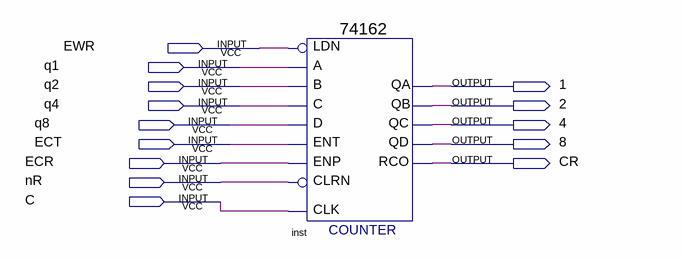
[diagram p0: schematic sheet]
// Quartus schematic kp15533IE11.bdf as structural Verilog: 1 symbols, 14 pins
module kp15533IE11 (
  input  EWR,
  input  q1,
  input  q2,
  input  q4,
  input  q8,
  input  ECT,
  input  ECR,
  input  nR,
  input  C,
  output \1 ,
  output \2 ,
  output \4 ,
  output \8 ,
  output CR
);

  \74162  inst (
    .A(q1), .LDN(EWR), .B(q2), .C(q4), .D(q8), .ENP(ECR), .ENT(ECT), .CLRN(nR), .CLK(C), .QA(\1 ), .QB(\2 ),
    .QC(\4 ), .QD(\8 ), .RCO(CR));
endmodule
